# Altium schematic sheet daisy-chain_isolation.SchDoc: foxBMS BMS-Interface
size A3; DocumentNumber: 4; SheetNumber: 4; SheetTotal: 6; Author: Fraunhofer IISB foxBMS Team; REL-DATE: 2017-05-09; VERSION: 1.1.0; GateName_1: G$1; SymbolName_1: FRAME_B_L; LibraryName: foxBMS_BMS-Master_V1.00_A; DeviceSetName: FRAME_B_L; GateName_2: G$2; SymbolName_2: DOCFIELD; SheetDescription: Daisy Chain Isolation
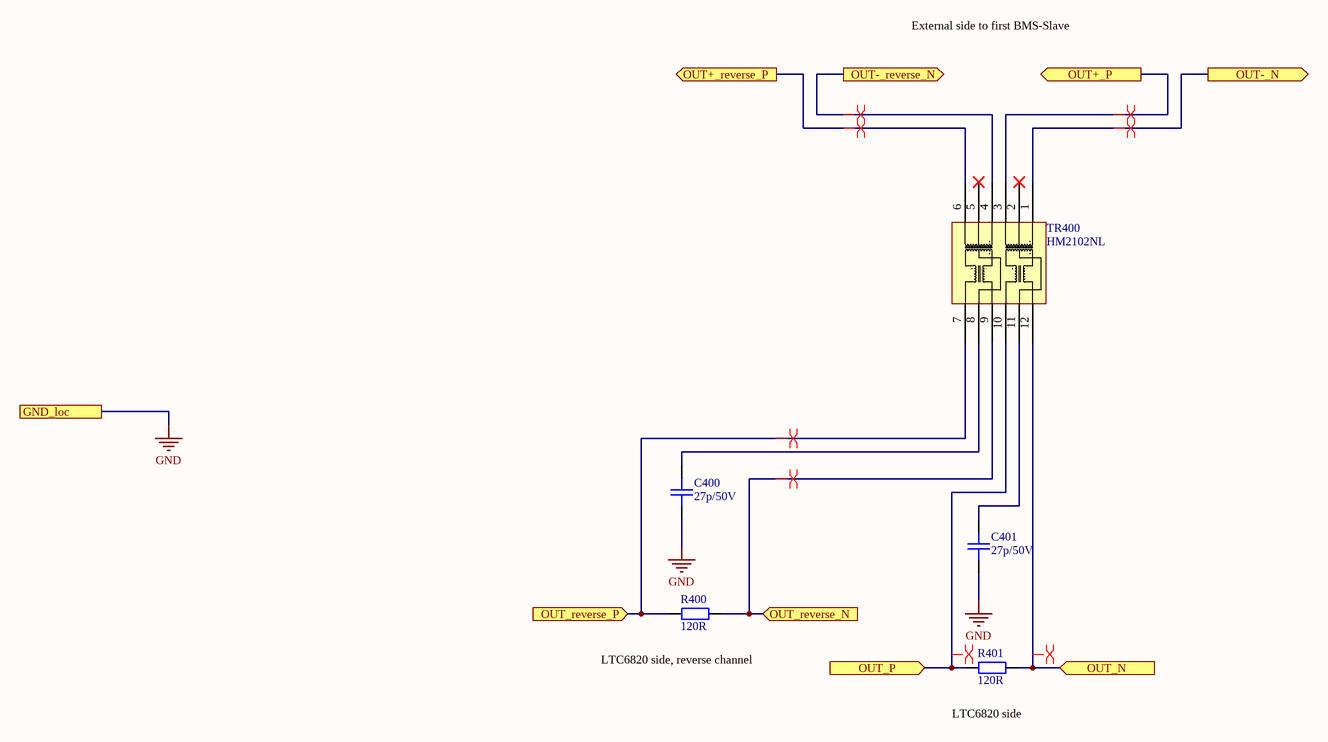
[diagram p0: daisy-chain_isolation.SchDoc]

## Parts
C400  27p/50V  [CAPC1608X08N]
C401  27p/50V  [CAPC1608X08N]
R400  120R  [RESC1608X05N]
R401  120R  [RESC1608X05N]
TR400  HM2102NL  [HM2102NL]

## Ports
GND_loc, OUT+_P (out), OUT+_reverse_P (out), OUT-_N (out), OUT-_reverse_N (out), OUT_N (in), OUT_P (in), OUT_reverse_N (in), OUT_reverse_P (in)

## Nets
GND: C400.1 C401.1 ; port GND_loc
OUT+_P: TR400.3 ; port OUT+_P
OUT+_reverse_P: TR400.6 ; port OUT+_reverse_P
OUT-_N: TR400.1 ; port OUT-_N
OUT-_reverse_N: TR400.4 ; port OUT-_reverse_N
OUT_N: R401.2 TR400.12 ; port OUT_N
OUT_P: R401.1 TR400.10 ; port OUT_P
OUT_reverse_N: R400.2 TR400.9 ; port OUT_reverse_N
OUT_reverse_P: R400.1 TR400.7 ; port OUT_reverse_P
NetC400_2: C400.2 TR400.8
NetC401_2: C401.2 TR400.11

Not connected (* = marked no-connect by the designer): TR400 2* 5*

## Layout directives
differential pair: OUT+_P, OUT+_reverse_P, OUT-_N, OUT-_reverse_N, OUT_N, OUT_P, OUT_reverse_N, OUT_reverse_P

## Notes on the sheet
- External side to first BMS-Slave
- (near R400) LTC6820 side, reverse channel
- (near R401) LTC6820 side
- Fraunhofer IISB
- Schottkystr. 10
- developed by:
- 91058 Erlangen
- Germany
- Author
- Project
- License
- Description
- File
- Version
- Release Date
- Sheet
- www.foxbms.org
- www.iisb.fraunhofer.de
- foxBMS Team
- /

## Library data of the parts
C400 C401 = gen_C_ceramic_27p_50V_NP0_0603: MLCC; Capacitance: 27p; Rated Voltage: 50V; Dielectric: NP0; Case EIA: 0603; Case Metric: 1608; PnP Package: C_0603_05; Automotive Qualified: True; Part Number: gen_C_ceramic_27p_50V_NP0_0603; Supplier 1: Farnell; Supplier Part Number 1: 2219430; PnP Value: *
R400 R401 = gen_R_120R_0603: SMD Resistor 120R 0603; Tolerance: 1%; Power: 0.1W; Case EIA: 0603; Case Metric: 1608; Maximum Working Voltage: 75V; PnP Package: R_0603; Automotive Qualified: True; Part Number: gen_R_120R_0603; Operating Temperature: -55°C - +155°C; Resistance: 120R; Series: E24; PnP Value: 120R; Supplier 1: Farnell; Supplier Part Number 1: 1652832
TR400 = HM2102NL: Pulse HM2102NL BMS Transformer; Automotive Qualified: True; Part Number: HM2102NL; Manufacturer: Pulse; Operating Temperature: -40°C - +125°C; ComponentLink1Description: Datasheet; ComponentLink1URL: https://www.mouser.com/ds/2/336/HM2102NL-1218600.pdf; Supplier 1: Mouser; Supplier Part Number 1: 673-HM2102NL; Supplier 2: Digikey; Supplier Part Number 2: 1840-1034-1-ND